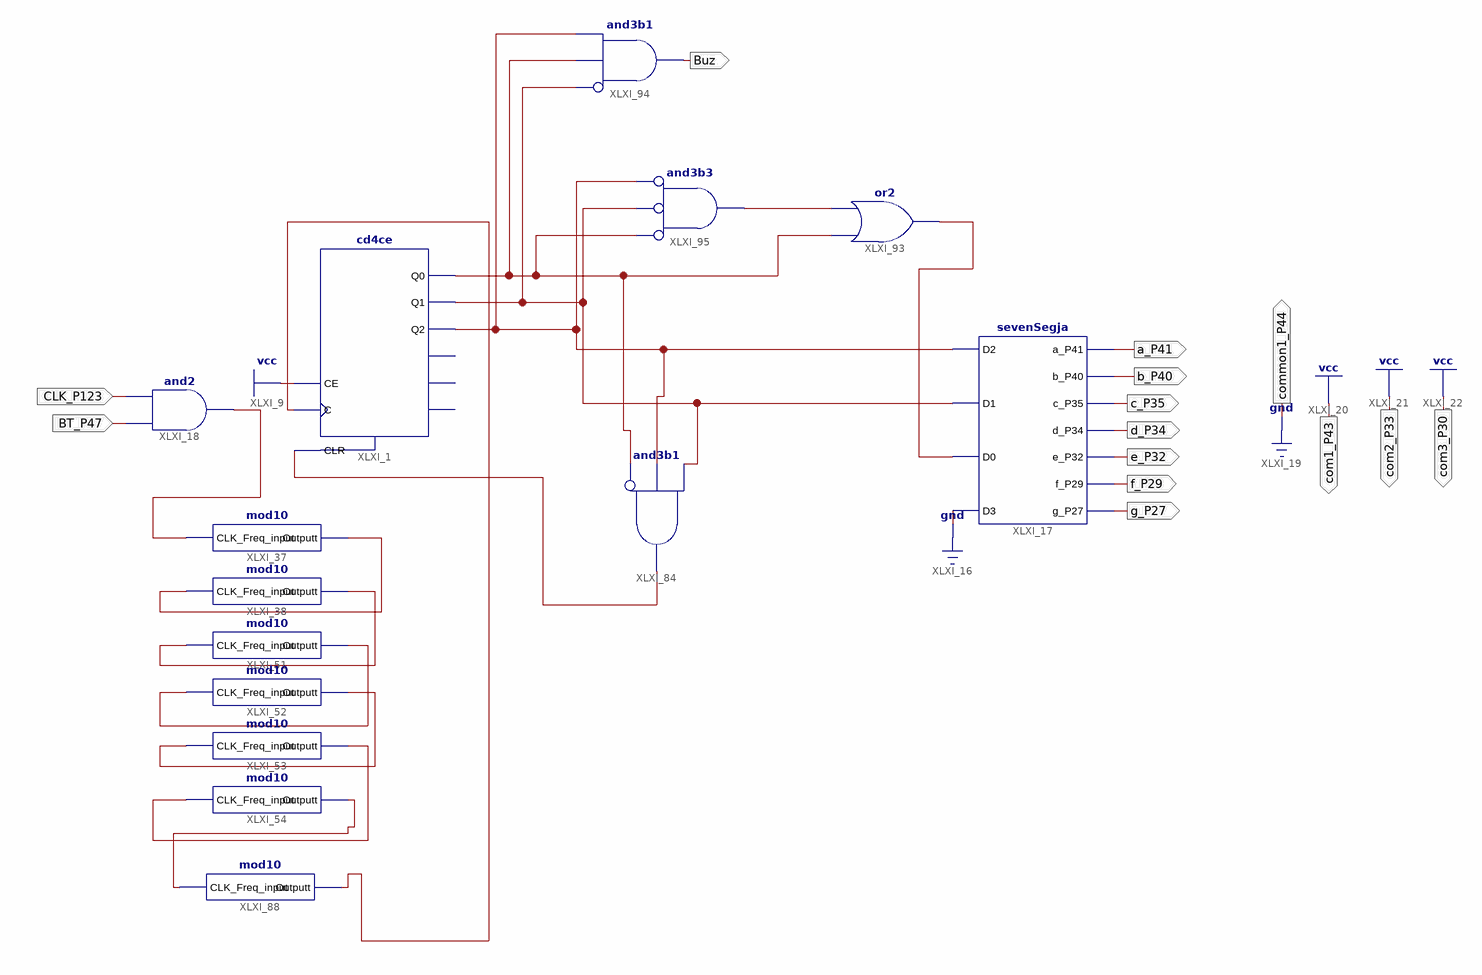
[diagram p0: schematic sheet 1]
// Xilinx ISE schematic count0_5.sch (spartan6) as structural Verilog: 14 symbols, 14 ports
module count0_5 (
  input  CLK_P123,
  input  BT_P47,
  output a_P41,
  output b_P40,
  output c_P35,
  output d_P34,
  output e_P32,
  output f_P29,
  output g_P27,
  output common1_P44,
  output com1_P43,
  output com2_P33,
  output com3_P30,
  output Buz
);

  wire XLXN_74, XLXN_105, XLXN_106, XLXN_107, XLXN_108, XLXN_109, XLXN_188, XLXN_208, XLXN_209, XLXN_224,
       XLXN_225, XLXN_229, XLXN_230, XLXN_231;

  sevenSegja XLXI_17 (
    .D2(XLXN_231), .D1(XLXN_230), .D0(XLXN_225), .D3(1'b0), .a_P41(a_P41), .b_P40(b_P40), .c_P35(c_P35),
    .d_P34(d_P34), .e_P32(e_P32), .f_P29(f_P29), .g_P27(g_P27));
  cd4ce XLXI_1 (
    .C(XLXN_209), .CE(1'b1), .CLR(XLXN_188), .Q0(XLXN_229), .Q1(XLXN_230), .Q2(XLXN_231));  // open: CEO, Q3, TC
  and XLXI_18 (XLXN_74, BT_P47, CLK_P123);
  mod10 XLXI_38 (.CLK_Freq_input(XLXN_105), .Outputt(XLXN_106));
  mod10 XLXI_51 (.CLK_Freq_input(XLXN_106), .Outputt(XLXN_107));
  mod10 XLXI_52 (.CLK_Freq_input(XLXN_107), .Outputt(XLXN_108));
  mod10 XLXI_53 (.CLK_Freq_input(XLXN_108), .Outputt(XLXN_109));
  mod10 XLXI_54 (.CLK_Freq_input(XLXN_109), .Outputt(XLXN_208));
  mod10 XLXI_37 (.CLK_Freq_input(XLXN_74), .Outputt(XLXN_105));
  and XLXI_84 (XLXN_188, ~XLXN_229, XLXN_231, XLXN_230);  // and3b1
  mod10 XLXI_88 (.CLK_Freq_input(XLXN_208), .Outputt(XLXN_209));
  or XLXI_93 (XLXN_225, XLXN_229, XLXN_224);
  and XLXI_94 (Buz, ~XLXN_230, XLXN_229, XLXN_231);  // and3b1
  and XLXI_95 (XLXN_224, ~XLXN_229, ~XLXN_230, ~XLXN_231);  // and3b3

  assign com1_P43 = 1'b1;
  assign com2_P33 = 1'b1;
  assign com3_P30 = 1'b1;
  assign common1_P44 = 1'b0;
endmodule
